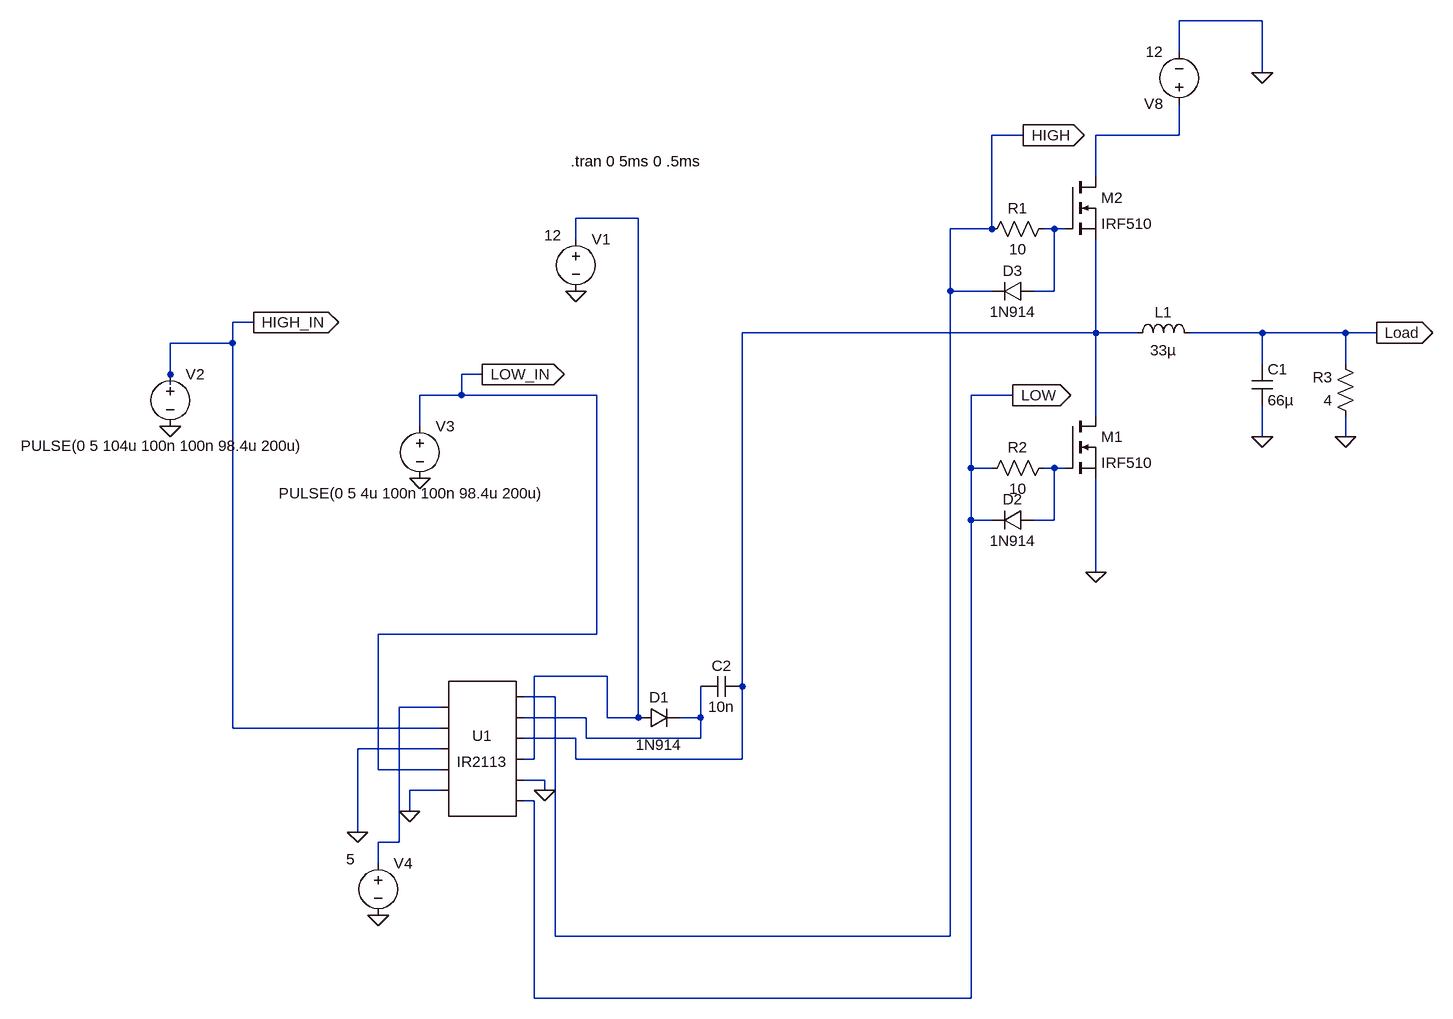
[diagram p0: schematic GateDriverDone.asc]
GateDriverDone.asc, the LTspice schematic file:
Version 4
SHEET 1 3556 1000
WIRE 768 -992 640 -992
WIRE 640 -944 640 -992
WIRE 768 -912 768 -992
WIRE 400 -816 352 -816
WIRE 640 -816 640 -864
WIRE 640 -816 512 -816
WIRE 512 -752 512 -816
WIRE -192 -688 -288 -688
WIRE 352 -672 352 -816
WIRE 352 -672 288 -672
WIRE 448 -672 432 -672
WIRE 464 -672 448 -672
WIRE -288 -656 -288 -688
WIRE 288 -576 288 -672
WIRE 352 -576 288 -576
WIRE 448 -576 448 -672
WIRE 448 -576 416 -576
WIRE -784 -528 -816 -528
WIRE 512 -512 512 -656
WIRE 512 -512 -32 -512
WIRE 576 -512 512 -512
WIRE 768 -512 656 -512
WIRE 896 -512 768 -512
WIRE 944 -512 896 -512
WIRE -816 -496 -816 -528
WIRE -816 -496 -912 -496
WIRE 768 -464 768 -512
WIRE 896 -464 896 -512
WIRE -912 -448 -912 -496
WIRE -432 -448 -464 -448
WIRE -912 -432 -912 -448
WIRE -464 -416 -464 -448
WIRE -464 -416 -528 -416
WIRE -256 -416 -464 -416
WIRE 384 -416 320 -416
WIRE 512 -384 512 -512
WIRE -528 -368 -528 -416
WIRE 768 -352 768 -400
WIRE 896 -352 896 -384
WIRE 320 -304 320 -416
WIRE 352 -304 320 -304
WIRE 448 -304 432 -304
WIRE 464 -304 448 -304
WIRE 320 -224 320 -304
WIRE 352 -224 320 -224
WIRE 448 -224 448 -304
WIRE 448 -224 416 -224
WIRE 512 -144 512 -288
WIRE -256 -48 -256 -416
WIRE -256 -48 -592 -48
WIRE -240 16 -352 16
WIRE -32 32 -32 -512
WIRE -320 48 -368 48
WIRE -496 64 -560 64
WIRE -272 80 -368 80
WIRE -240 80 -240 16
WIRE -192 80 -192 -688
WIRE -192 80 -240 80
WIRE -96 80 -96 32
WIRE -96 80 -128 80
WIRE -816 96 -816 -496
WIRE -496 96 -816 96
WIRE -288 112 -368 112
WIRE -272 112 -272 80
WIRE -96 112 -96 80
WIRE -96 112 -272 112
WIRE -496 128 -624 128
WIRE -352 144 -352 16
WIRE -352 144 -368 144
WIRE -288 144 -288 112
WIRE -32 144 -32 32
WIRE -32 144 -288 144
WIRE -592 160 -592 -48
WIRE -496 160 -592 160
WIRE -336 176 -368 176
WIRE -496 192 -544 192
WIRE -336 192 -336 176
WIRE -352 208 -368 208
WIRE -544 224 -544 192
WIRE -624 256 -624 128
WIRE -560 272 -560 64
WIRE -560 272 -592 272
WIRE -592 304 -592 272
WIRE -320 416 -320 48
WIRE 288 416 288 -576
WIRE 288 416 -320 416
WIRE -352 512 -352 208
WIRE 320 512 320 -224
WIRE 320 512 -352 512
FLAG 768 -912 0
FLAG 896 -352 0
FLAG 768 -352 0
FLAG 944 -512 Load
IOPIN 944 -512 Out
FLAG 400 -816 HIGH
IOPIN 400 -816 Out
FLAG 384 -416 LOW
IOPIN 384 -416 Out
FLAG -784 -528 HIGH_IN
IOPIN -784 -528 Out
FLAG -432 -448 LOW_IN
IOPIN -432 -448 Out
FLAG -336 192 0
FLAG -288 -576 0
FLAG -912 -368 0
FLAG -528 -288 0
FLAG 512 -144 0
FLAG -624 256 0
FLAG -544 224 0
FLAG -592 384 0
SYMBOL res 448 -688 R90
WINDOW 0 0 56 VBottom 2
WINDOW 3 32 56 VTop 2
SYMATTR InstName R1
SYMATTR Value 10
SYMBOL res 448 -320 R90
WINDOW 0 0 56 VBottom 2
WINDOW 3 32 56 VTop 2
SYMATTR InstName R2
SYMATTR Value 10
SYMBOL voltage -288 -672 R0
WINDOW 3 -49 10 Left 2
WINDOW 123 0 0 Left 0
WINDOW 39 0 0 Left 0
SYMATTR Value 12
SYMATTR InstName V1
SYMBOL voltage -912 -464 R0
WINDOW 3 -230 126 Left 2
WINDOW 123 0 0 Left 0
WINDOW 39 0 0 Left 0
SYMATTR Value PULSE(0 5 104u 100n 100n 98.4u 200u)
SYMATTR InstName V2
SYMBOL voltage -528 -384 R0
WINDOW 3 -217 119 Left 2
WINDOW 123 0 0 Left 0
WINDOW 39 0 0 Left 0
SYMATTR Value PULSE(0 5 4u 100n 100n 98.4u 200u)
SYMATTR InstName V3
SYMBOL diode -192 96 R270
WINDOW 0 32 32 VTop 2
WINDOW 3 -10 32 VBottom 2
SYMATTR InstName D1
SYMATTR Value 1N914
SYMBOL voltage 640 -848 R180
WINDOW 123 0 0 Left 0
WINDOW 39 0 0 Left 0
SYMATTR InstName V8
SYMATTR Value 12
SYMBOL nmos 464 -384 R0
SYMATTR InstName M1
SYMATTR Value IRF510
SYMBOL nmos 464 -752 R0
SYMATTR InstName M2
SYMATTR Value IRF510
SYMBOL res 912 -368 R180
WINDOW 0 36 76 Left 2
WINDOW 3 36 40 Left 2
SYMATTR InstName R3
SYMATTR Value 4
SYMATTR SpiceLine pwr=100
SYMBOL ind 560 -496 R270
WINDOW 0 32 56 VTop 2
WINDOW 3 5 56 VBottom 2
SYMATTR InstName L1
SYMATTR Value 33µ
SYMBOL cap 752 -464 R0
SYMATTR InstName C1
SYMATTR Value 66µ
SYMBOL cap -32 16 R90
WINDOW 0 0 32 VBottom 2
WINDOW 3 32 32 VTop 2
SYMATTR InstName C2
SYMATTR Value 10n
SYMBOL AutoGenerated\\IR2113 -432 128 R0
SYMATTR InstName U1
SYMBOL diode 416 -240 R90
WINDOW 0 0 32 VBottom 2
WINDOW 3 32 32 VTop 2
SYMATTR InstName D2
SYMATTR Value 1N914
SYMBOL diode 416 -592 R90
WINDOW 0 0 32 VBottom 2
WINDOW 3 32 32 VTop 2
SYMATTR InstName D3
SYMATTR Value 1N914
SYMBOL voltage -592 288 R0
WINDOW 3 -49 10 Left 2
WINDOW 123 0 0 Left 0
WINDOW 39 0 0 Left 0
SYMATTR Value 5
SYMATTR InstName V4
TEXT -296 -776 Left 2 !.tran 0 5ms 0 .5ms

The netlist it stands for:
* GateDriverDone.asc
R1 N003 HIGH 10
R2 N005 LOW 10
V1 N002 0 12
V2 HIGH_IN 0 PULSE(0 5 104u 100n 100n 98.4u 200u)
V3 LOW_IN 0 PULSE(0 5 4u 100n 100n 98.4u 200u)
D1 N002 N007 1N914
V8 N001 0 12
M1 N004 N005 0 0 IRF510
M2 N001 N003 N004 N004 IRF510
R3 0 Load 4 pwr=100
L1 N004 Load 33µ
C1 Load 0 66µ
C2 N004 N007 10n
* U1: IR2113 (symbol AutoGenerated\IR2113 not available, pins judged from their places): pin1=N006 pin2=HIGH_IN pin3=0 pin4=LOW_IN pin5=0 pin6=HIGH pin7=N007 pin8=N004 pin9=N002 pin10=0 pin11=LOW
D2 N005 LOW 1N914
D3 N003 HIGH 1N914
V4 N006 0 5
.model D D
.lib standard.dio
.model NMOS NMOS
.model PMOS PMOS
.lib standard.mos
.tran 0 5ms 0 .5ms
.backanno
.end